# Altium schematic sheet FPGA_2_PLEIADES.SchDoc
size Tabloid; SheetNumber: 2; SheetTotal: 8; Sheet_Name: Insert name in Document Parameters; Size: 11x17
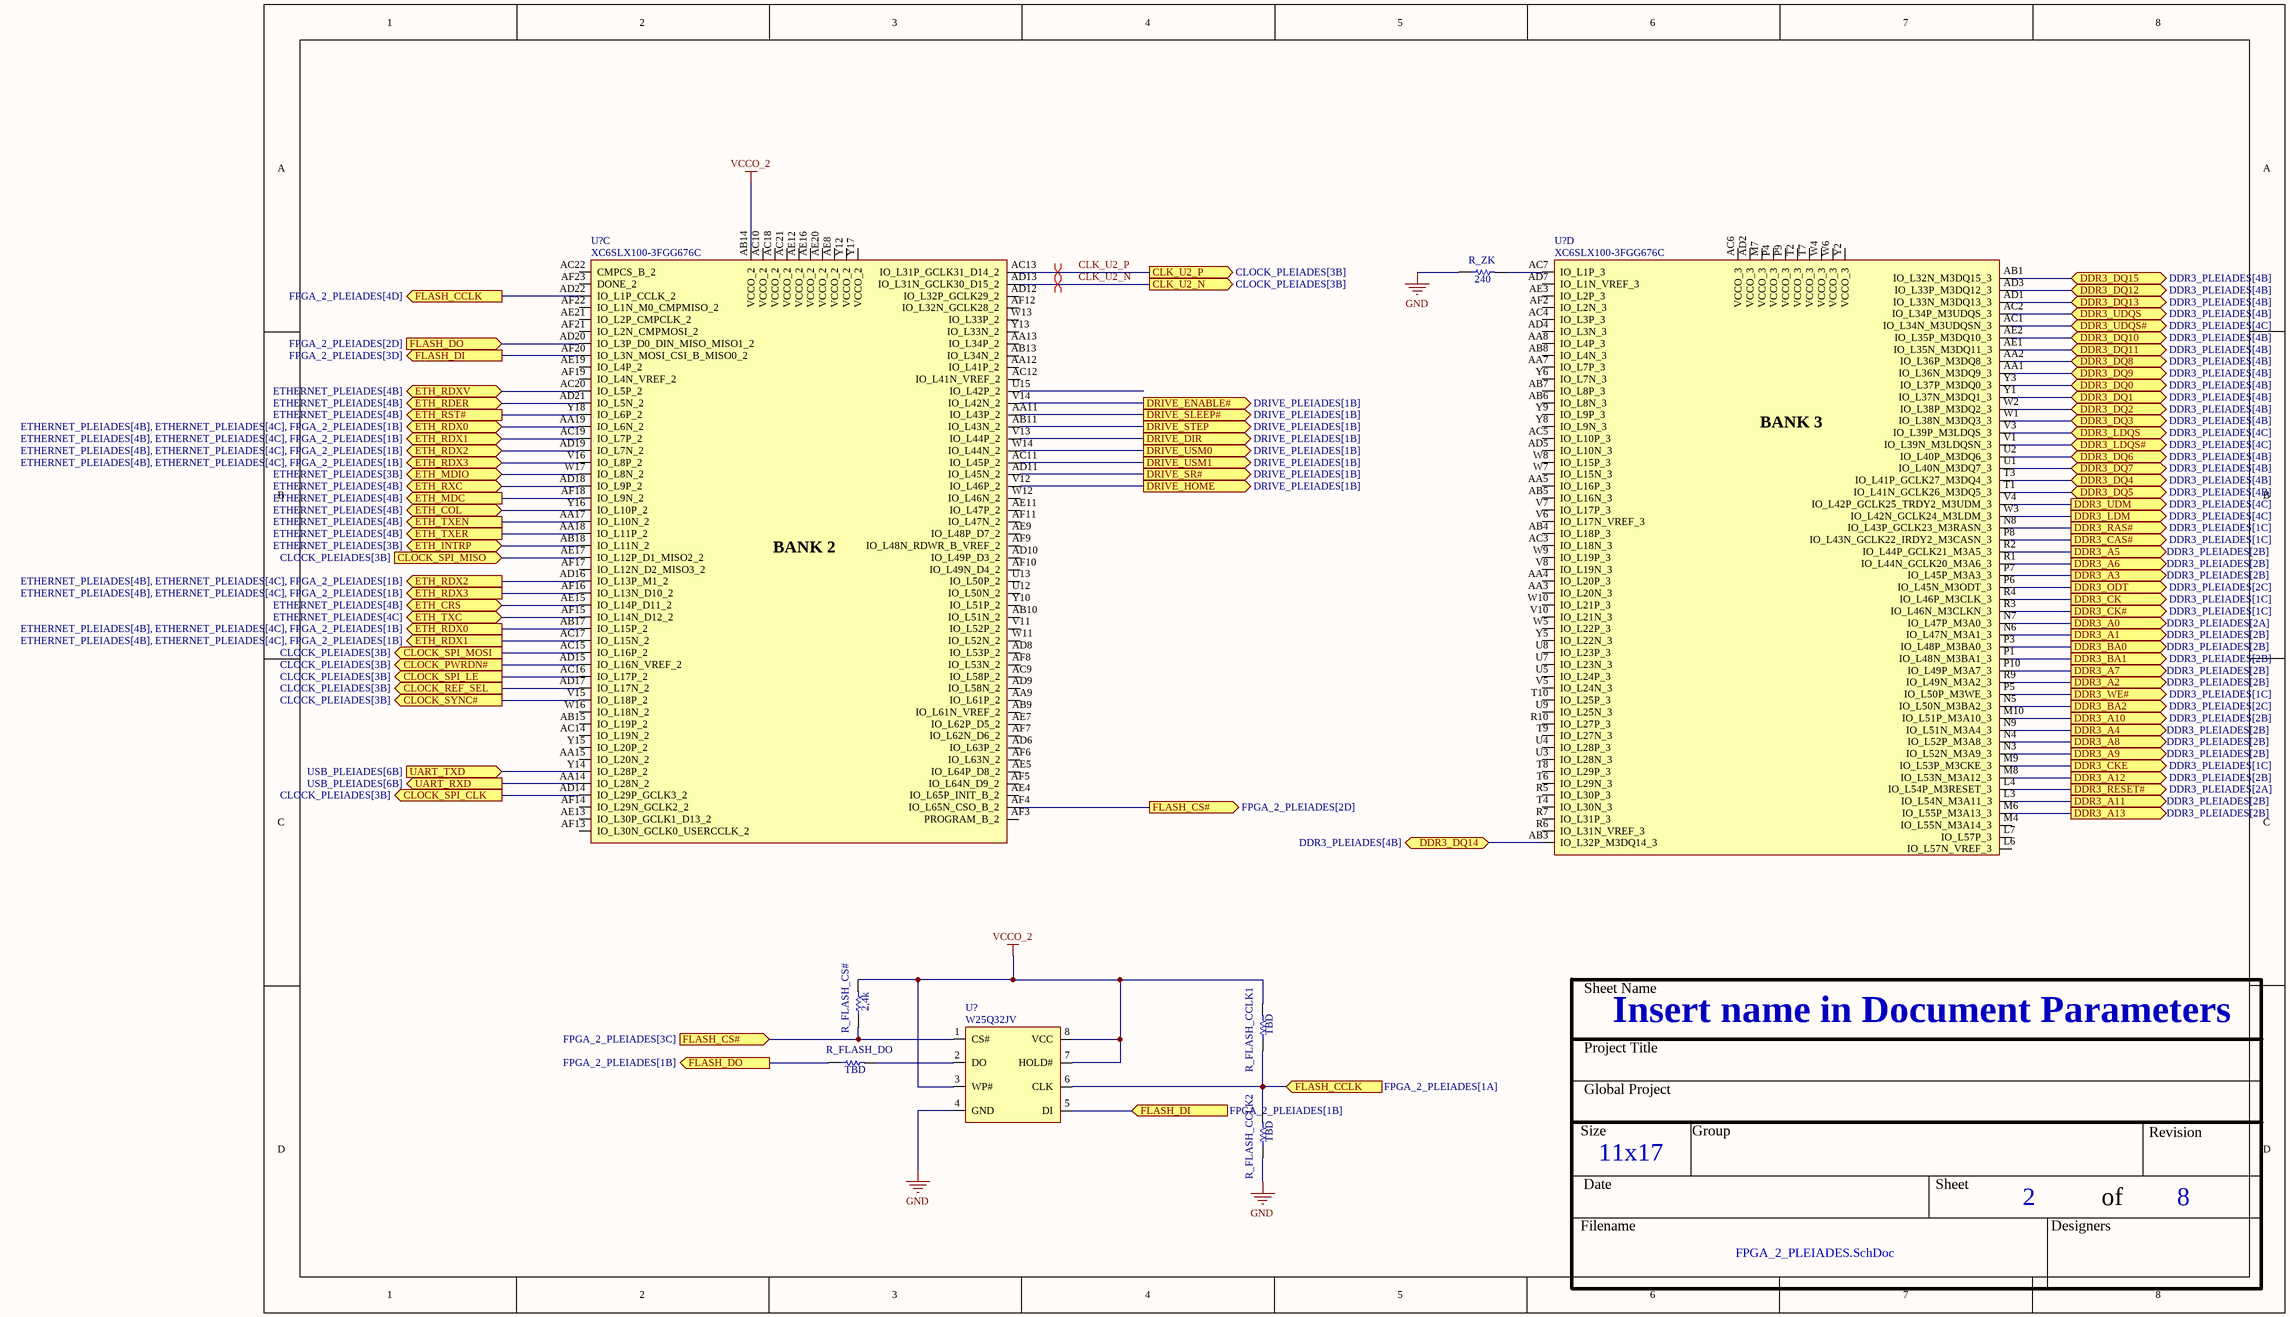
[diagram p0: FPGA_2_PLEIADES.SchDoc]

## Parts
(Parts that share a designator on the sheet are numbered #1, #2 ... from top to bottom, then left to right.)
R_FLASH_CCLK1  value TBD  [RES_0402]  (hidden comment: RES - 0402)
R_FLASH_CCLK2  value TBD  [RES_0402]  (hidden comment: RES - 0402)
R_FLASH_CS#  value 2,4k  [RES_0402]  (hidden comment: RES - 0402)
R_FLASH_DO  value TBD  [RES_0402]  (hidden comment: RES - 0402)
R_ZK  value 240  [RES_0402]  (hidden comment: RES - 0402)
U?#1  XC6SLX100-3FGG676C  [FPGA_XILINX_FGG676]  (part C of 10)
U?#2  XC6SLX100-3FGG676C  [FPGA_XILINX_FGG676]  (part D of 10)
U?#3  W25Q32JV  [SOIC127P790X216-8N]

## Ports
CLK_U2_N (out, see CLOCK_PLEIADES[3B]), CLK_U2_P (out, see CLOCK_PLEIADES[3B]), CLOCK_PWRDN# (out, see CLOCK_PLEIADES[3B]), CLOCK_REF_SEL (out, see CLOCK_PLEIADES[3B]), CLOCK_SPI_CLK (out, see CLOCK_PLEIADES[3B]), CLOCK_SPI_LE (out, see CLOCK_PLEIADES[3B]), CLOCK_SPI_MISO (in, see CLOCK_PLEIADES[3B]), CLOCK_SPI_MOSI (out, see CLOCK_PLEIADES[3B]), CLOCK_SYNC# (out, see CLOCK_PLEIADES[3B]), DDR3_A0 (out, see DDR3_PLEIADES[2A]), DDR3_A1 (out, see DDR3_PLEIADES[2B]), DDR3_A2 (out, see DDR3_PLEIADES[2B]), DDR3_A3 (out, see DDR3_PLEIADES[2B]), DDR3_A4 (out, see DDR3_PLEIADES[2B]), DDR3_A5 (out, see DDR3_PLEIADES[2B]), DDR3_A6 (out, see DDR3_PLEIADES[2B]), DDR3_A7 (out, see DDR3_PLEIADES[2B]), DDR3_A8 (out, see DDR3_PLEIADES[2B]), DDR3_A9 (out, see DDR3_PLEIADES[2B]), DDR3_A10 (out, see DDR3_PLEIADES[2B]), DDR3_A11 (out, see DDR3_PLEIADES[2B]), DDR3_A12 (out, see DDR3_PLEIADES[2B]), DDR3_A13 (out, see DDR3_PLEIADES[2B]), DDR3_BA0 (out, see DDR3_PLEIADES[2B]), DDR3_BA1 (out, see DDR3_PLEIADES[2B]), DDR3_BA2 (out, see DDR3_PLEIADES[2C]), DDR3_CAS# (out, see DDR3_PLEIADES[1C]), DDR3_CK (out, see DDR3_PLEIADES[1C]), DDR3_CK# (out, see DDR3_PLEIADES[1C]), DDR3_CKE (out, see DDR3_PLEIADES[1C]), DDR3_DQ0 (bidir, see DDR3_PLEIADES[4B]), DDR3_DQ1 (bidir, see DDR3_PLEIADES[4B]), DDR3_DQ2 (bidir, see DDR3_PLEIADES[4B]), DDR3_DQ3 (bidir, see DDR3_PLEIADES[4B]), DDR3_DQ4 (bidir, see DDR3_PLEIADES[4B]), DDR3_DQ5 (bidir, see DDR3_PLEIADES[4B]), DDR3_DQ6 (bidir, see DDR3_PLEIADES[4B]), DDR3_DQ7 (bidir, see DDR3_PLEIADES[4B]), DDR3_DQ8 (bidir, see DDR3_PLEIADES[4B]), DDR3_DQ9 (bidir, see DDR3_PLEIADES[4B]), DDR3_DQ10 (bidir, see DDR3_PLEIADES[4B]), DDR3_DQ11 (bidir, see DDR3_PLEIADES[4B]), DDR3_DQ12 (bidir, see DDR3_PLEIADES[4B]), DDR3_DQ13 (bidir, see DDR3_PLEIADES[4B]), DDR3_DQ14 (bidir, see DDR3_PLEIADES[4B]), DDR3_DQ15 (bidir, see DDR3_PLEIADES[4B]), DDR3_LDM (out, see DDR3_PLEIADES[4C]), DDR3_LDQS (bidir, see DDR3_PLEIADES[4C]), DDR3_LDQS# (bidir, see DDR3_PLEIADES[4C]), DDR3_ODT (out, see DDR3_PLEIADES[2C]), DDR3_RAS# (out, see DDR3_PLEIADES[1C]), DDR3_RESET# (out, see DDR3_PLEIADES[2A]), DDR3_UDM (out, see DDR3_PLEIADES[4C]), DDR3_UDQS (bidir, see DDR3_PLEIADES[4B]), DDR3_UDQS# (bidir, see DDR3_PLEIADES[4C]), DDR3_WE# (out, see DDR3_PLEIADES[1C]), DRIVE_DIR (out, see DRIVE_PLEIADES[1B]), DRIVE_ENABLE# (out, see DRIVE_PLEIADES[1B]), DRIVE_HOME (out, see DRIVE_PLEIADES[1B]), DRIVE_SLEEP# (out, see DRIVE_PLEIADES[1B]), DRIVE_SR# (out, see DRIVE_PLEIADES[1B]), DRIVE_STEP (out, see DRIVE_PLEIADES[1B]), DRIVE_USM0 (out, see DRIVE_PLEIADES[1B]), DRIVE_USM1 (out, see DRIVE_PLEIADES[1B]), ETH_COL (bidir, see ETHERNET_PLEIADES[4B]), ETH_CRS (bidir, see ETHERNET_PLEIADES[4B]), ETH_INTRP (bidir, see ETHERNET_PLEIADES[3B]), ETH_MDC (out, see ETHERNET_PLEIADES[4B]), ETH_MDIO (bidir, see ETHERNET_PLEIADES[3B]), ETH_RDER (bidir, see ETHERNET_PLEIADES[4B]), ETH_RDX0 (bidir, see ETHERNET_PLEIADES[4B], ETHERNET_PLEIADES[4C], FPGA_2_PLEIADES[1B]), ETH_RDX0 (out, see ETHERNET_PLEIADES[4B], ETHERNET_PLEIADES[4C], FPGA_2_PLEIADES[1B]), ETH_RDX1 (bidir, see ETHERNET_PLEIADES[4B], ETHERNET_PLEIADES[4C], FPGA_2_PLEIADES[1B]), ETH_RDX1 (out, see ETHERNET_PLEIADES[4B], ETHERNET_PLEIADES[4C], FPGA_2_PLEIADES[1B]), ETH_RDX2 (bidir, see ETHERNET_PLEIADES[4B], ETHERNET_PLEIADES[4C], FPGA_2_PLEIADES[1B]), ETH_RDX2 (out, see ETHERNET_PLEIADES[4B], ETHERNET_PLEIADES[4C], FPGA_2_PLEIADES[1B]), ETH_RDX3 (bidir, see ETHERNET_PLEIADES[4B], ETHERNET_PLEIADES[4C], FPGA_2_PLEIADES[1B]), ETH_RDX3 (out, see ETHERNET_PLEIADES[4B], ETHERNET_PLEIADES[4C], FPGA_2_PLEIADES[1B]), ETH_RDXV (bidir, see ETHERNET_PLEIADES[4B]), ETH_RST# (out, see ETHERNET_PLEIADES[4B]), ETH_RXC (bidir, see ETHERNET_PLEIADES[4B]), ETH_TXC (bidir, see ETHERNET_PLEIADES[4C]), ETH_TXEN (out, see ETHERNET_PLEIADES[4B]), ETH_TXER (out, see ETHERNET_PLEIADES[4B]), FLASH_CCLK (in, see FPGA_2_PLEIADES[1A]), FLASH_CCLK (out, see FPGA_2_PLEIADES[4D]), FLASH_CS# (in, see FPGA_2_PLEIADES[3C]), FLASH_CS# (out, see FPGA_2_PLEIADES[2D]), FLASH_DI (in, see FPGA_2_PLEIADES[1B]), FLASH_DI (out, see FPGA_2_PLEIADES[3D]), FLASH_DO (in, see FPGA_2_PLEIADES[2D]), FLASH_DO (out, see FPGA_2_PLEIADES[1B]), UART_RXD (out, see USB_PLEIADES[6B]), UART_TXD (in, see USB_PLEIADES[6B])

## Nets
GND: R_FLASH_CCLK2.1 R_ZK.1 U?#3.4(GND)
VCCO_2: R_FLASH_CCLK1.2 R_FLASH_CS#.2 U?#1.AB14(VCCO_2) U?#3.3(WP#) U?#3.7(HOLD#) U?#3.8(VCC)
CLK_U2_N: U?#1.AD13(IO_L31N_GCLK30_D15_2) ; port CLK_U2_N
CLK_U2_P: U?#1.AC13(IO_L31P_GCLK31_D14_2) ; port CLK_U2_P
CLOCK_PWRDN#: U?#1.AD15(IO_L16N_VREF_2) ; port CLOCK_PWRDN#
CLOCK_REF_SEL: U?#1.AD17(IO_L17N_2) ; port CLOCK_REF_SEL
CLOCK_SPI_CLK: U?#1.AD14(IO_L29P_GCLK3_2) ; port CLOCK_SPI_CLK
CLOCK_SPI_LE: U?#1.AC16(IO_L17P_2) ; port CLOCK_SPI_LE
CLOCK_SPI_MISO: U?#1.AE17(IO_L12P_D1_MISO2_2) ; port CLOCK_SPI_MISO
CLOCK_SPI_MOSI: U?#1.AC15(IO_L16P_2) ; port CLOCK_SPI_MOSI
CLOCK_SYNC#: U?#1.V15(IO_L18P_2) ; port CLOCK_SYNC#
DDR3_A0: U?#2.N7(IO_L47P_M3A0_3) ; port DDR3_A0
DDR3_A1: U?#2.N6(IO_L47N_M3A1_3) ; port DDR3_A1
DDR3_A2: U?#2.R9(IO_L49N_M3A2_3) ; port DDR3_A2
DDR3_A3: U?#2.P7(IO_L45P_M3A3_3) ; port DDR3_A3
DDR3_A4: U?#2.N9(IO_L51N_M3A4_3) ; port DDR3_A4
DDR3_A5: U?#2.R2(IO_L44P_GCLK21_M3A5_3) ; port DDR3_A5
DDR3_A6: U?#2.R1(IO_L44N_GCLK20_M3A6_3) ; port DDR3_A6
DDR3_A7: U?#2.P10(IO_L49P_M3A7_3) ; port DDR3_A7
DDR3_A8: U?#2.N4(IO_L52P_M3A8_3) ; port DDR3_A8
DDR3_A9: U?#2.N3(IO_L52N_M3A9_3) ; port DDR3_A9
DDR3_A10: U?#2.M10(IO_L51P_M3A10_3) ; port DDR3_A10
DDR3_A11: U?#2.L3(IO_L54N_M3A11_3) ; port DDR3_A11
DDR3_A12: U?#2.M8(IO_L53N_M3A12_3) ; port DDR3_A12
DDR3_A13: U?#2.M6(IO_L55P_M3A13_3) ; port DDR3_A13
DDR3_BA0: U?#2.P3(IO_L48P_M3BA0_3) ; port DDR3_BA0
DDR3_BA1: U?#2.P1(IO_L48N_M3BA1_3) ; port DDR3_BA1
DDR3_BA2: U?#2.N5(IO_L50N_M3BA2_3) ; port DDR3_BA2
DDR3_CAS#: U?#2.P8(IO_L43N_GCLK22_IRDY2_M3CASN_3) ; port DDR3_CAS#
DDR3_CK: U?#2.R4(IO_L46P_M3CLK_3) ; port DDR3_CK
DDR3_CK#: U?#2.R3(IO_L46N_M3CLKN_3) ; port DDR3_CK#
DDR3_CKE: U?#2.M9(IO_L53P_M3CKE_3) ; port DDR3_CKE
DDR3_DQ0: U?#2.Y3(IO_L37P_M3DQ0_3) ; port DDR3_DQ0
DDR3_DQ1: U?#2.Y1(IO_L37N_M3DQ1_3) ; port DDR3_DQ1
DDR3_DQ2: U?#2.W2(IO_L38P_M3DQ2_3) ; port DDR3_DQ2
DDR3_DQ3: U?#2.W1(IO_L38N_M3DQ3_3) ; port DDR3_DQ3
DDR3_DQ4: U?#2.T3(IO_L41P_GCLK27_M3DQ4_3) ; port DDR3_DQ4
DDR3_DQ5: U?#2.T1(IO_L41N_GCLK26_M3DQ5_3) ; port DDR3_DQ5
DDR3_DQ6: U?#2.U2(IO_L40P_M3DQ6_3) ; port DDR3_DQ6
DDR3_DQ7: U?#2.U1(IO_L40N_M3DQ7_3) ; port DDR3_DQ7
DDR3_DQ8: U?#2.AA2(IO_L36P_M3DQ8_3) ; port DDR3_DQ8
DDR3_DQ9: U?#2.AA1(IO_L36N_M3DQ9_3) ; port DDR3_DQ9
DDR3_DQ10: U?#2.AE2(IO_L35P_M3DQ10_3) ; port DDR3_DQ10
DDR3_DQ11: U?#2.AE1(IO_L35N_M3DQ11_3) ; port DDR3_DQ11
DDR3_DQ12: U?#2.AD3(IO_L33P_M3DQ12_3) ; port DDR3_DQ12
DDR3_DQ13: U?#2.AD1(IO_L33N_M3DQ13_3) ; port DDR3_DQ13
DDR3_DQ14: U?#2.AB3(IO_L32P_M3DQ14_3) ; port DDR3_DQ14
DDR3_DQ15: U?#2.AB1(IO_L32N_M3DQ15_3) ; port DDR3_DQ15
DDR3_LDM: U?#2.W3(IO_L42N_GCLK24_M3LDM_3) ; port DDR3_LDM
DDR3_LDQS: U?#2.V3(IO_L39P_M3LDQS_3) ; port DDR3_LDQS
DDR3_LDQS#: U?#2.V1(IO_L39N_M3LDQSN_3) ; port DDR3_LDQS#
DDR3_ODT: U?#2.P6(IO_L45N_M3ODT_3) ; port DDR3_ODT
DDR3_RAS#: U?#2.N8(IO_L43P_GCLK23_M3RASN_3) ; port DDR3_RAS#
DDR3_RESET#: U?#2.L4(IO_L54P_M3RESET_3) ; port DDR3_RESET#
DDR3_UDM: U?#2.V4(IO_L42P_GCLK25_TRDY2_M3UDM_3) ; port DDR3_UDM
DDR3_UDQS: U?#2.AC2(IO_L34P_M3UDQS_3) ; port DDR3_UDQS
DDR3_UDQS#: U?#2.AC1(IO_L34N_M3UDQSN_3) ; port DDR3_UDQS#
DDR3_WE#: U?#2.P5(IO_L50P_M3WE_3) ; port DDR3_WE#
DRIVE_DIR: U?#1.V13(IO_L44P_2) ; port DRIVE_DIR
DRIVE_ENABLE#: U?#1.V14(IO_L42N_2) ; port DRIVE_ENABLE#
DRIVE_HOME: U?#1.V12(IO_L46P_2) ; port DRIVE_HOME
DRIVE_SLEEP#: U?#1.AA11(IO_L43P_2) ; port DRIVE_SLEEP#
DRIVE_SR#: U?#1.AD11(IO_L45N_2) ; port DRIVE_SR#
DRIVE_STEP: U?#1.AB11(IO_L43N_2) ; port DRIVE_STEP
DRIVE_USM0: U?#1.W14(IO_L44N_2) ; port DRIVE_USM0
DRIVE_USM1: U?#1.AC11(IO_L45P_2) ; port DRIVE_USM1
ETH_COL: U?#1.Y16(IO_L10P_2) ; port ETH_COL
ETH_CRS: U?#1.AE15(IO_L14P_D11_2) ; port ETH_CRS
ETH_INTRP: U?#1.AB18(IO_L11N_2) ; port ETH_INTRP
ETH_MDC: U?#1.AF18(IO_L9N_2) ; port ETH_MDC
ETH_MDIO: U?#1.W17(IO_L8N_2) ; port ETH_MDIO
ETH_RDER: U?#1.AD21(IO_L5N_2) ; port ETH_RDER
ETH_RDX0: U?#1.AA19(IO_L6N_2) U?#1.AB17(IO_L15P_2) ; port ETH_RDX0
ETH_RDX1: U?#1.AC17(IO_L15N_2) U?#1.AC19(IO_L7P_2) ; port ETH_RDX1
ETH_RDX2: U?#1.AD16(IO_L13P_M1_2) U?#1.AD19(IO_L7N_2) ; port ETH_RDX2
ETH_RDX3: U?#1.AF16(IO_L13N_D10_2) U?#1.V16(IO_L8P_2) ; port ETH_RDX3
ETH_RDXV: U?#1.AC20(IO_L5P_2) ; port ETH_RDXV
ETH_RST#: U?#1.Y18(IO_L6P_2) ; port ETH_RST#
ETH_RXC: U?#1.AD18(IO_L9P_2) ; port ETH_RXC
ETH_TXC: U?#1.AF15(IO_L14N_D12_2) ; port ETH_TXC
ETH_TXEN: U?#1.AA17(IO_L10N_2) ; port ETH_TXEN
ETH_TXER: U?#1.AA18(IO_L11P_2) ; port ETH_TXER
FLASH_CCLK: R_FLASH_CCLK1.1 R_FLASH_CCLK2.2 U?#1.AD22(IO_L1P_CCLK_2) U?#3.6(CLK) ; port FLASH_CCLK
FLASH_CS#: R_FLASH_CS#.1 U?#1.AF4(IO_L65N_CSO_B_2) U?#3.1(CS#) ; port FLASH_CS#
FLASH_DI: U?#1.AF20(IO_L3N_MOSI_CSI_B_MISO0_2) U?#3.5(DI) ; port FLASH_DI
FLASH_DO: R_FLASH_DO.1 U?#1.AD20(IO_L3P_D0_DIN_MISO_MISO1_2) ; port FLASH_DO
UART_RXD: U?#1.AA14(IO_L28N_2) ; port UART_RXD
UART_TXD: U?#1.Y14(IO_L28P_2) ; port UART_TXD
NetR_FLASH_DO_2: R_FLASH_DO.2 U?#3.2(DO)
NetR_ZK_2: R_ZK.2 U?#2.AC7(IO_L1P_3)

Not connected (* = marked no-connect by the designer): U?#1 AA9(IO_L61P_2) AA12(IO_L41P_2) AA13(IO_L34P_2) AA15(IO_L20N_2) AB9(IO_L61N_VREF_2) AB10(IO_L51N_2) AB13(IO_L34N_2) AB15(IO_L19P_2) AC9(IO_L58P_2) AC10(VCCO_2) AC12(IO_L41N_VREF_2) AC14(IO_L19N_2) AC18(VCCO_2) AC21(VCCO_2) AC22(CMPCS_B_2) AD6(IO_L63P_2) AD8(IO_L53P_2) AD9(IO_L58N_2) AD10(IO_L49P_D3_2) AD12(IO_L32P_GCLK29_2) AE4(IO_L65P_INIT_B_2) AE5(IO_L64P_D8_2) AE7(IO_L62P_D5_2) AE8(VCCO_2) AE9(IO_L48P_D7_2) AE11(IO_L47P_2) AE12(VCCO_2) AE13(IO_L30P_GCLK1_D13_2) AE16(VCCO_2) AE19(IO_L4P_2) AE20(VCCO_2) AE21(IO_L2P_CMPCLK_2) AF3(PROGRAM_B_2) AF5(IO_L64N_D9_2) AF6(IO_L63N_2) AF7(IO_L62N_D6_2) AF8(IO_L53N_2) AF9(IO_L48N_RDWR_B_VREF_2) AF10(IO_L49N_D4_2) AF11(IO_L47N_2) AF12(IO_L32N_GCLK28_2) AF13(IO_L30N_GCLK0_USERCCLK_2) AF14(IO_L29N_GCLK2_2) AF17(IO_L12N_D2_MISO3_2) AF19(IO_L4N_VREF_2) AF21(IO_L2N_CMPMOSI_2) AF22(IO_L1N_M0_CMPMISO_2) AF23(DONE_2) U12(IO_L50N_2) U13(IO_L50P_2) U15(IO_L42P_2) V11(IO_L52P_2) W11(IO_L52N_2) W12(IO_L46N_2) W13(IO_L33P_2) W16(IO_L18N_2) Y10(IO_L51P_2) Y12(VCCO_2) Y13(IO_L33N_2) Y15(IO_L20P_2) Y17(VCCO_2); U?#2 AA3(IO_L20N_3) AA4(IO_L20P_3) AA5(IO_L16P_3) AA7(IO_L7P_3) AA8(IO_L4P_3) AB4(IO_L18P_3) AB5(IO_L16N_3) AB6(IO_L8N_3) AB7(IO_L8P_3) AB8(IO_L4N_3) AC3(IO_L18N_3) AC4(IO_L3P_3) AC5(IO_L10P_3) AC6(VCCO_3) AD2(VCCO_3) AD4(IO_L3N_3) AD5(IO_L10N_3) AD7(IO_L1N_VREF_3) AE3(IO_L2P_3) AF2(IO_L2N_3) L6(IO_L57N_VREF_3) L7(IO_L57P_3) M4(IO_L55N_M3A14_3) M7(VCCO_3) P4(VCCO_3) P9(VCCO_3) R5(IO_L30P_3) R6(IO_L31N_VREF_3) R7(IO_L31P_3) R10(IO_L27P_3) T2(VCCO_3) T4(IO_L30N_3) T6(IO_L29N_3) T7(VCCO_3) T8(IO_L29P_3) T9(IO_L27N_3) T10(IO_L25P_3) U3(IO_L28N_3) U4(IO_L28P_3) U5(IO_L24P_3) U7(IO_L23N_3) U8(IO_L23P_3) U9(IO_L25N_3) V5(IO_L24N_3) V6(IO_L17N_VREF_3) V7(IO_L17P_3) V8(IO_L19N_3) V10(IO_L21N_3) W4(VCCO_3) W5(IO_L22P_3) W6(VCCO_3) W7(IO_L15N_3) W8(IO_L15P_3) W9(IO_L19P_3) W10(IO_L21P_3) Y2(VCCO_3) Y5(IO_L22N_3) Y6(IO_L7N_3) Y8(IO_L9N_3) Y9(IO_L9P_3)

## Layout directives
differential pair: CLK_U2_N, CLK_U2_P

## Notes on the sheet
- Sheet Name
- Project Title
- Global Project
- Size
- Group
- Revision
- Date
- Sheet
- of
- Filename
- Designers
- (in symbol FPGA_XC6SLX100-3FGG676C, part C) BANK 2
- (in symbol FPGA_XC6SLX100-3FGG676C, part D) BANK 3

## Library data of the parts
R_FLASH_CCLK1 R_FLASH_CCLK2 R_FLASH_CS# R_FLASH_DO R_ZK = RES - 0402: Voltage: 50V; Power: 1/16W; Precision: 1%; Current: *; CreatedBy: Jonathan Bouchard; Package: 0402
U?#1 U?#2 = FPGA_XC6SLX100-3FGG676C: FPGA - XILINX SPARTAN 6 480 I/O - BGA-676; Voltage: 1.14 V ~ 1.26 V; Current: *; Power: *; Mfg: Xilinx; Mfg Part Number: XC6SLX100-3FGG676C; HelpURL: https://www.xilinx.com/support/documentation/data_sheets/ds162.pdf; CreatedBy: Jonathan Bouchard; Temperature: 0°C ~ 85°C (TJ); Value: *; Precision: *; Package: BGA-676; Supplier 1: Digikey; Supplier Part Number 1: 122-1760-ND
U?#3 = CMP-00001-1: 3V 32M-BIT SERIAL FLASH MEMORY WITH DUAL, QUAD SPI